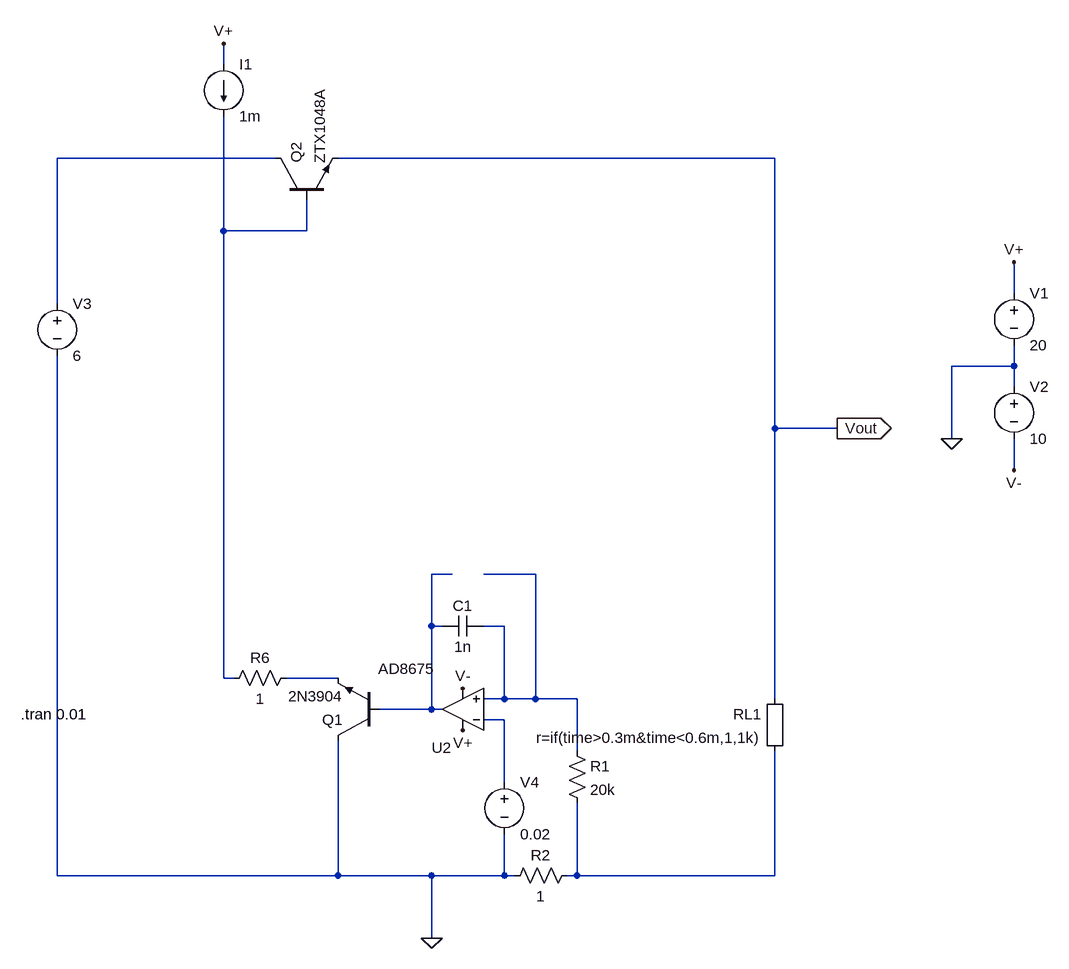
[diagram p0: schematic Draft1.asc]
Draft1.asc, the LTspice schematic file:
Version 4
SHEET 1 1552 1284
WIRE -272 -112 -272 -144
WIRE -192 32 -528 32
WIRE 576 32 -96 32
WIRE -272 144 -272 -32
WIRE -144 144 -144 96
WIRE -144 144 -272 144
WIRE 944 240 944 192
WIRE -528 256 -528 32
WIRE 944 352 944 320
WIRE 944 352 848 352
WIRE 944 384 944 352
WIRE 576 448 576 32
WIRE 672 448 576 448
WIRE 848 464 848 352
WIRE 944 512 944 464
WIRE 80 672 48 672
WIRE 208 672 128 672
WIRE 48 752 48 672
WIRE 64 752 48 752
WIRE 160 752 128 752
WIRE -272 832 -272 144
WIRE -256 832 -272 832
WIRE -96 832 -176 832
WIRE 160 864 160 752
WIRE 160 864 128 864
WIRE 208 864 208 672
WIRE 208 864 160 864
WIRE 272 864 208 864
WIRE 576 864 576 448
WIRE 48 880 48 752
WIRE 48 880 -32 880
WIRE 64 880 48 880
WIRE 160 896 128 896
WIRE 272 944 272 864
WIRE 160 992 160 896
WIRE -528 1136 -528 336
WIRE -96 1136 -96 928
WIRE -96 1136 -528 1136
WIRE 48 1136 -96 1136
WIRE 160 1136 160 1072
WIRE 160 1136 48 1136
WIRE 176 1136 160 1136
WIRE 272 1136 272 1024
WIRE 272 1136 256 1136
WIRE 576 1136 576 944
WIRE 576 1136 272 1136
WIRE 48 1232 48 1136
FLAG 944 192 V+
FLAG 944 512 V-
FLAG 672 448 Vout
IOPIN 672 448 Out
FLAG 48 1232 0
FLAG 848 464 0
FLAG 96 912 V+
FLAG 96 848 V-
FLAG -272 -144 V+
SYMBOL voltage 944 224 R0
WINDOW 123 0 0 Left 0
WINDOW 39 0 0 Left 0
SYMATTR InstName V1
SYMATTR Value 20
SYMBOL voltage 944 368 R0
WINDOW 123 0 0 Left 0
WINDOW 39 0 0 Left 0
SYMATTR InstName V2
SYMATTR Value 10
SYMBOL voltage -528 240 R0
WINDOW 123 0 0 Left 0
WINDOW 39 0 0 Left 0
SYMATTR InstName V3
SYMATTR Value 6
SYMBOL res 272 1120 R90
WINDOW 0 0 56 VBottom 2
WINDOW 3 32 56 VTop 2
SYMATTR InstName R2
SYMATTR Value 1
SYMBOL npn -192 96 R270
SYMATTR InstName Q2
SYMATTR Value ZTX1048A
SYMBOL Opamps\\AD8675 96 944 R180
WINDOW 0 17 5 Left 2
WINDOW 3 43 126 Left 2
SYMATTR InstName U2
SYMBOL res -160 816 R90
WINDOW 0 0 56 VBottom 2
WINDOW 3 32 56 VTop 2
SYMATTR InstName R6
SYMATTR Value 1
SYMBOL Misc\\EuropeanResistor 592 848 M0
SYMATTR InstName RL1
SYMATTR Value r=if(time>0.3m&time<0.6m,1,1k)
SYMBOL voltage 160 976 R0
WINDOW 123 0 0 Left 0
WINDOW 39 0 0 Left 0
SYMATTR InstName V4
SYMATTR Value 0.02
SYMBOL npn -32 928 R180
SYMATTR InstName Q1
SYMATTR Value 2N3904
SYMBOL current -272 -112 R0
WINDOW 123 0 0 Left 0
WINDOW 39 0 0 Left 0
SYMATTR InstName I1
SYMATTR Value 1m
SYMBOL cap 128 736 R90
WINDOW 0 0 32 VBottom 2
WINDOW 3 32 32 VTop 2
SYMATTR InstName C1
SYMATTR Value 1n
SYMBOL res 256 928 R0
SYMATTR InstName R1
SYMATTR Value 20k
TEXT -584 888 Left 2 !.tran 0.01

The netlist it stands for:
* Draft1.asc
V1 V+ 0 20
V2 0 V- 10
V3 N001 0 6
R2 N007 0 1
Q2 N001 N002 Vout 0 ZTX1048A
XU2 N004 N006 V+ V- N003 AD8675  ; pins In+ In- V+ V- OUT
R6 N005 N002 1
RL1 Vout N007 r=if(time>0.3m&time<0.6m,1,1k)
V4 N006 0 0.02
Q1 0 N003 N005 0 2N3904
I1 V+ N002 1m
C1 N004 N003 1n
R1 N004 N007 20k
.model NPN NPN
.model PNP PNP
.lib standard.bjt
.tran 0.01
.backanno
.end